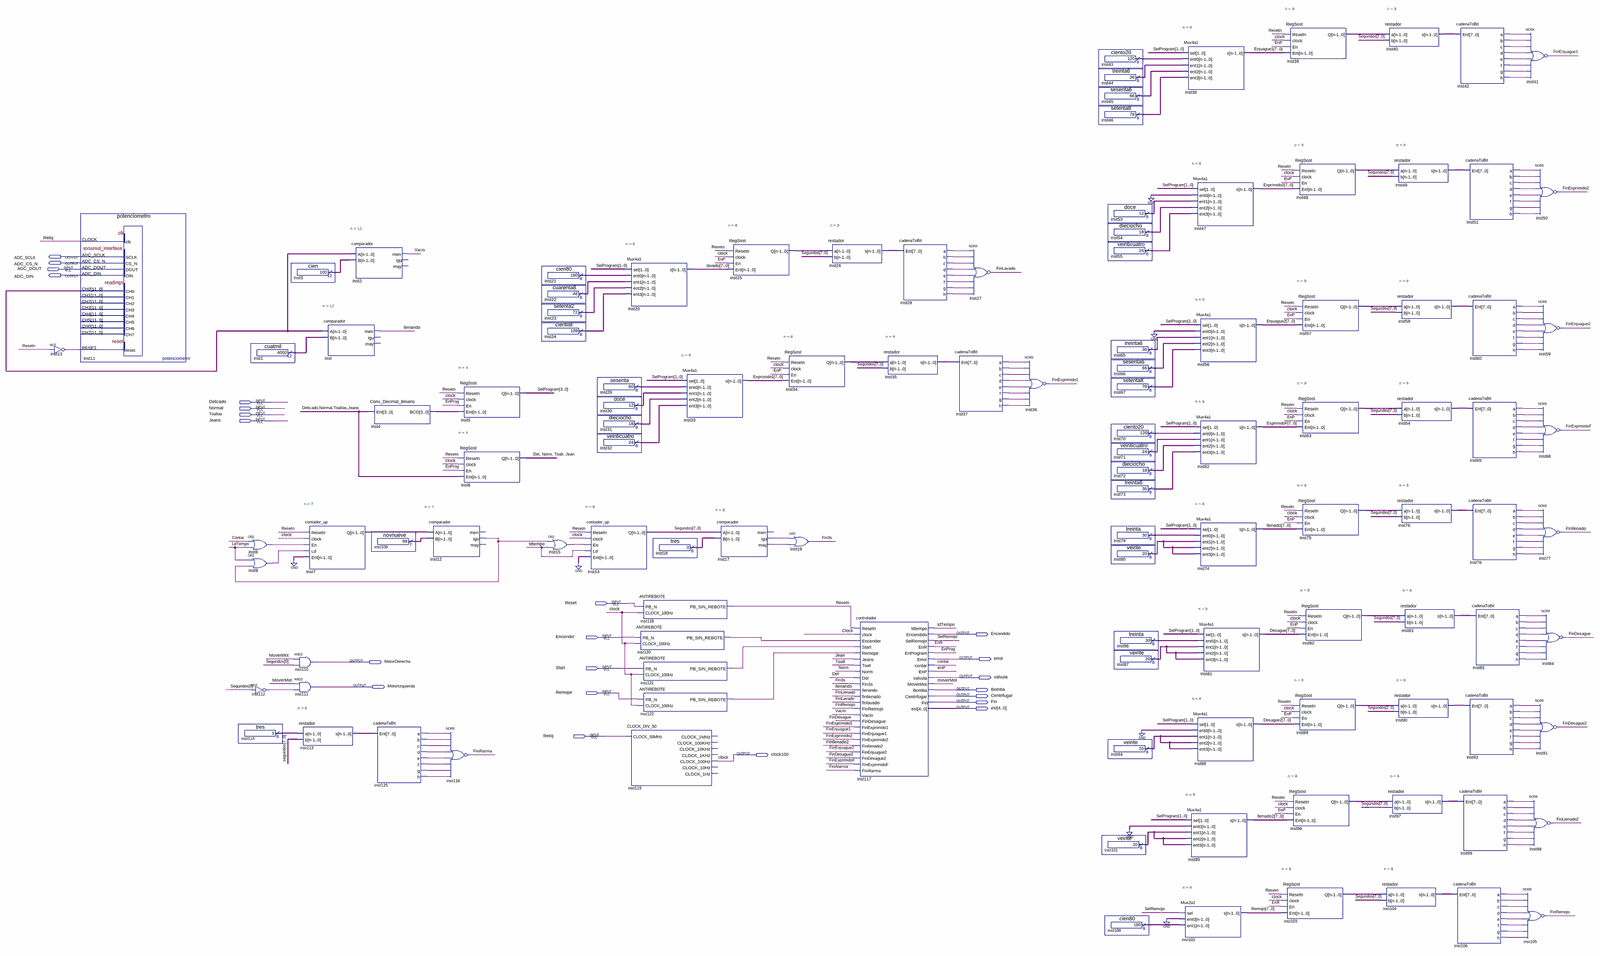
[diagram p0: schematic sheet, whole]
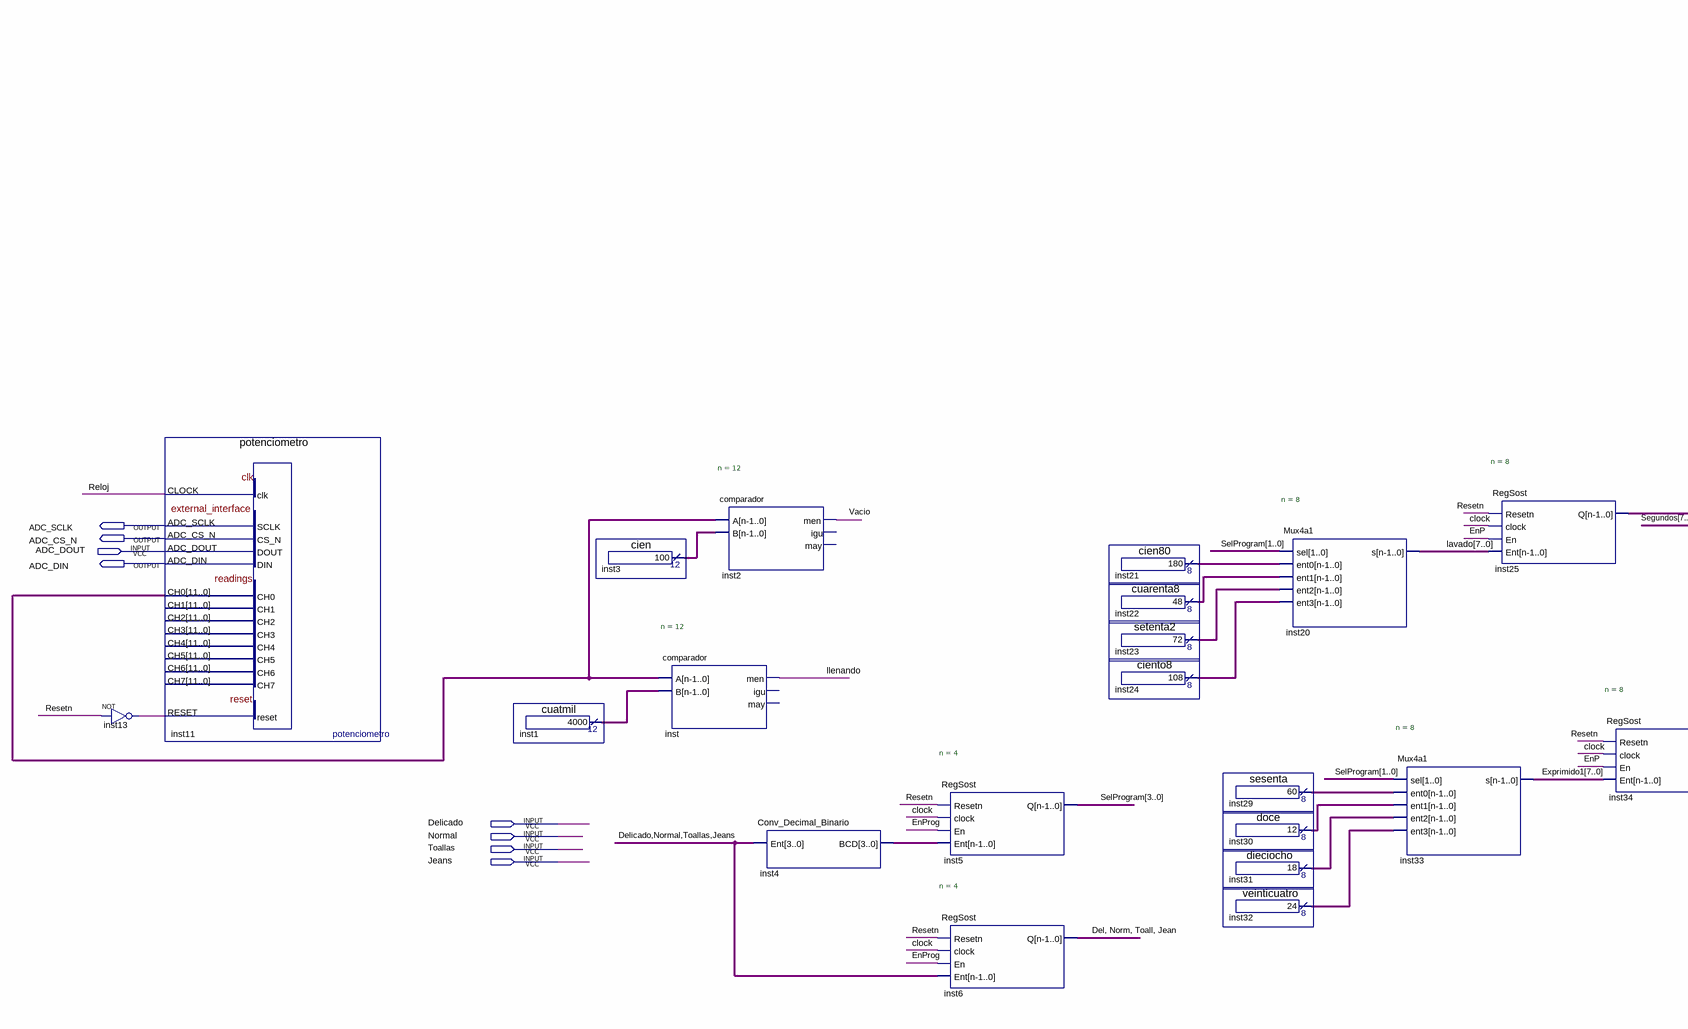
[diagram p1: schematic sheet, upper left part]
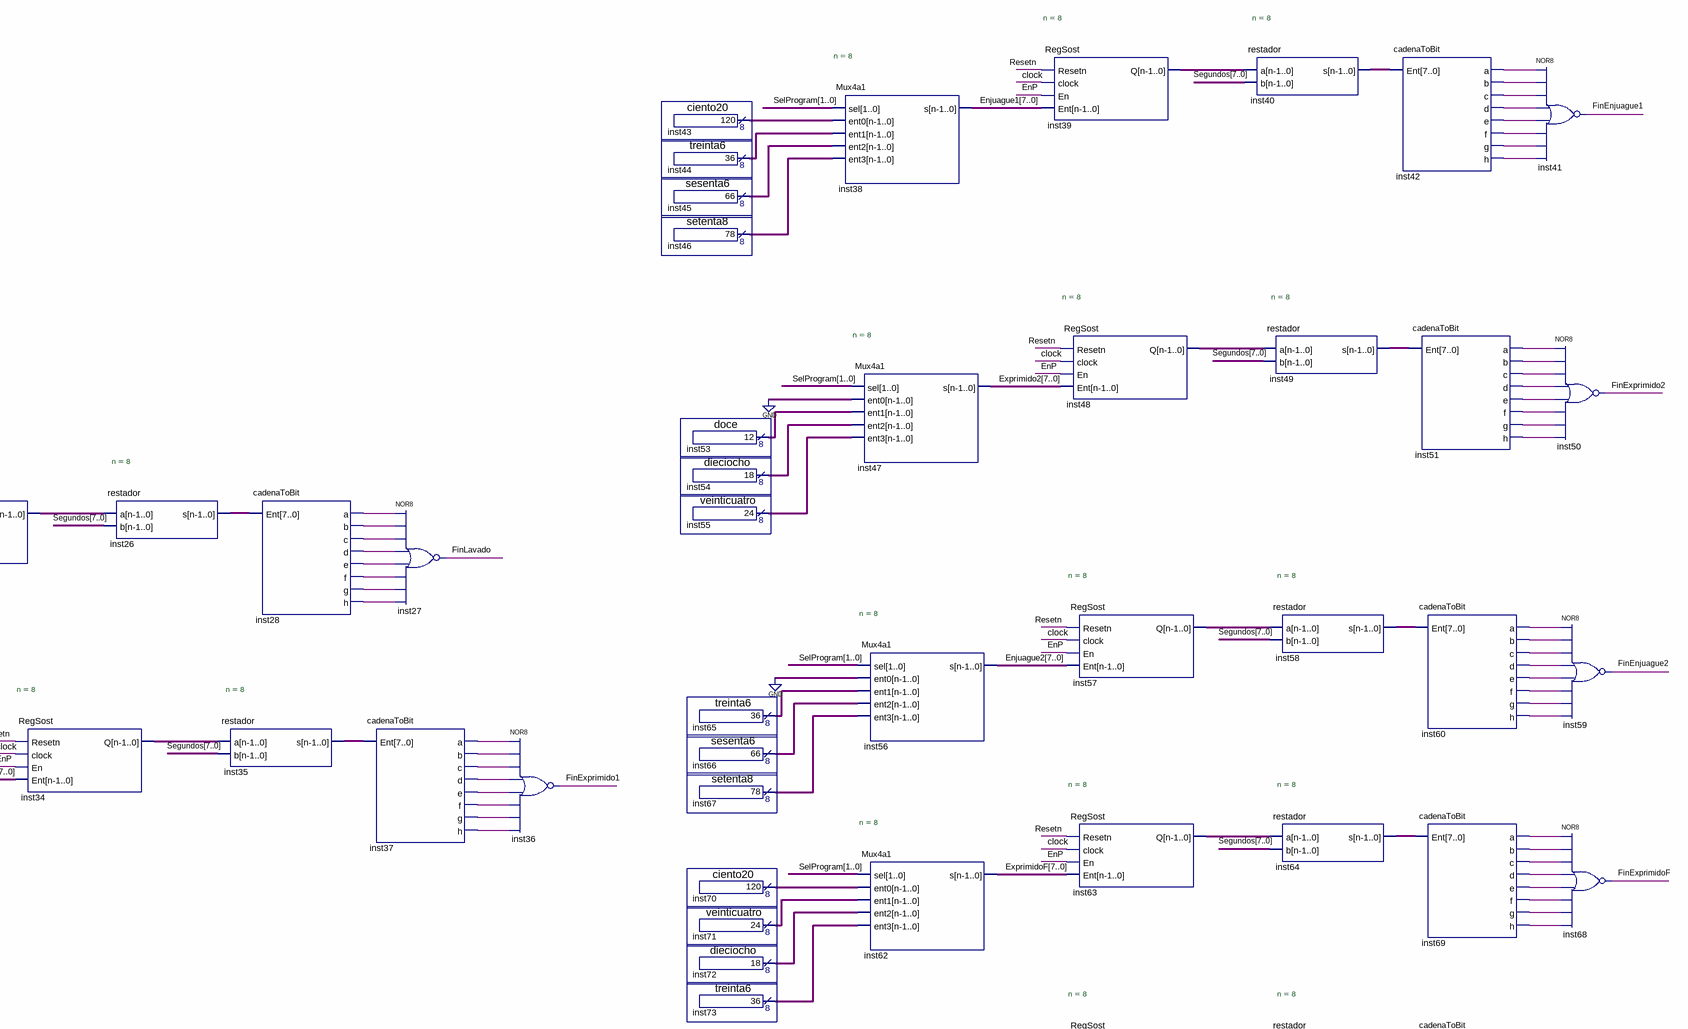
[diagram p2: schematic sheet, upper right part]
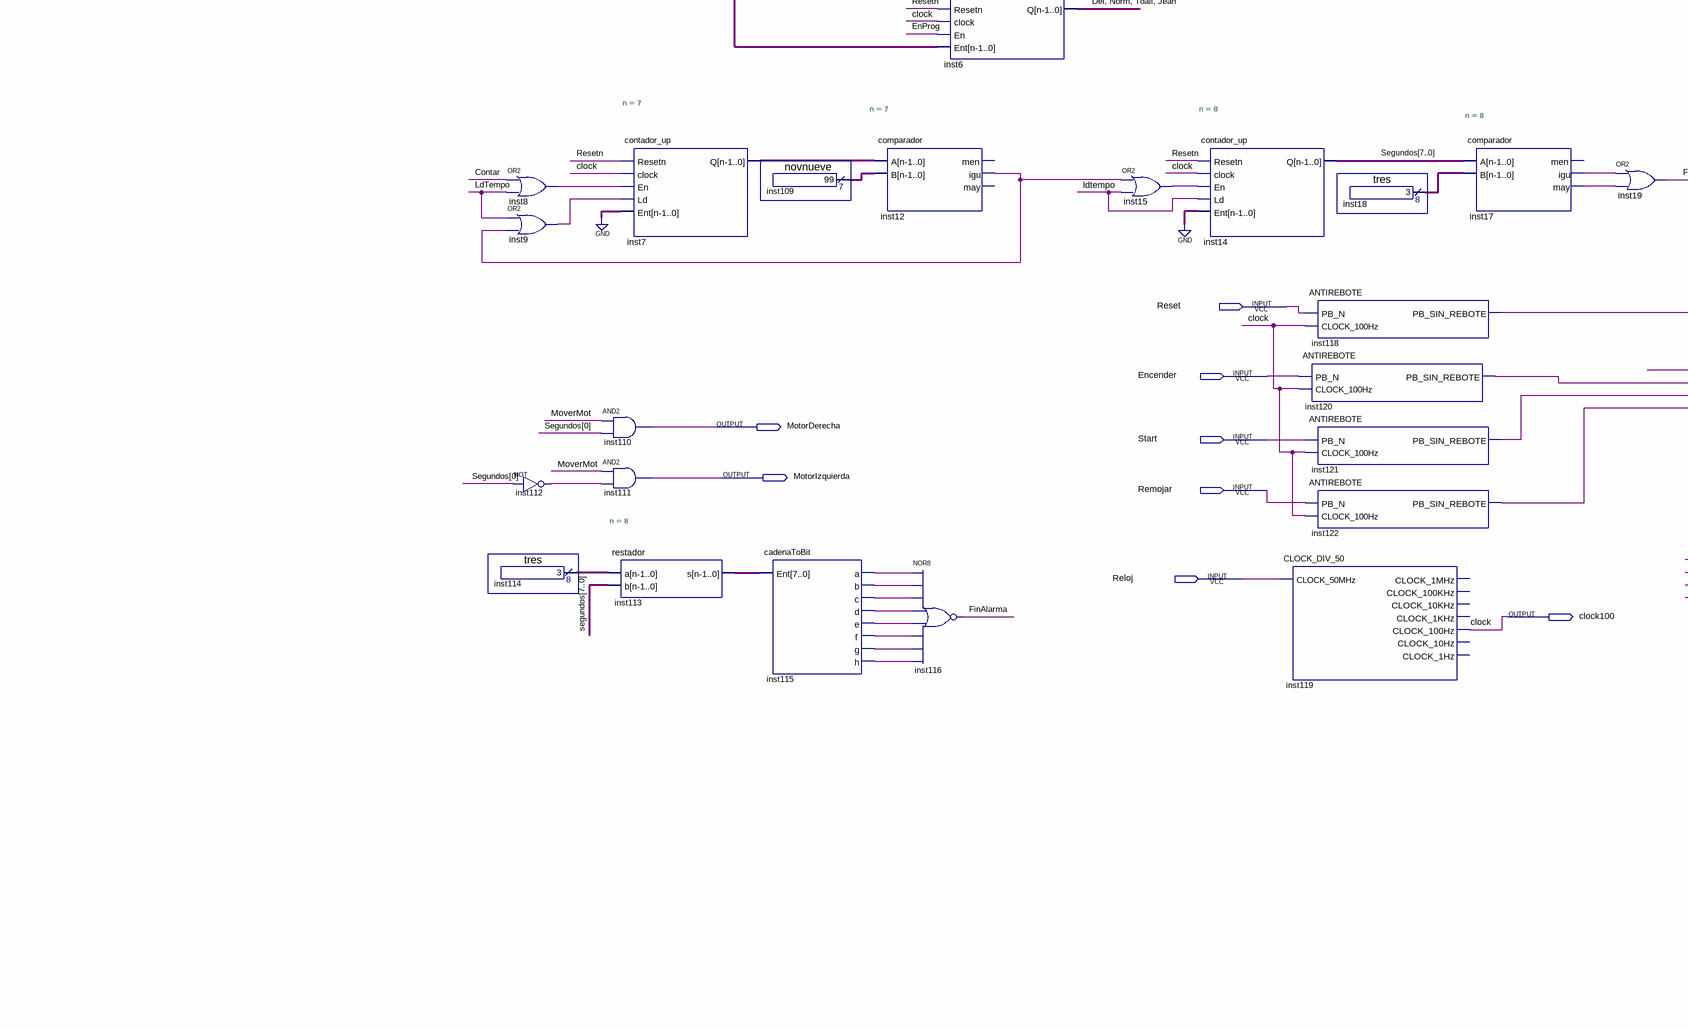
[diagram p3: schematic sheet, lower left part]
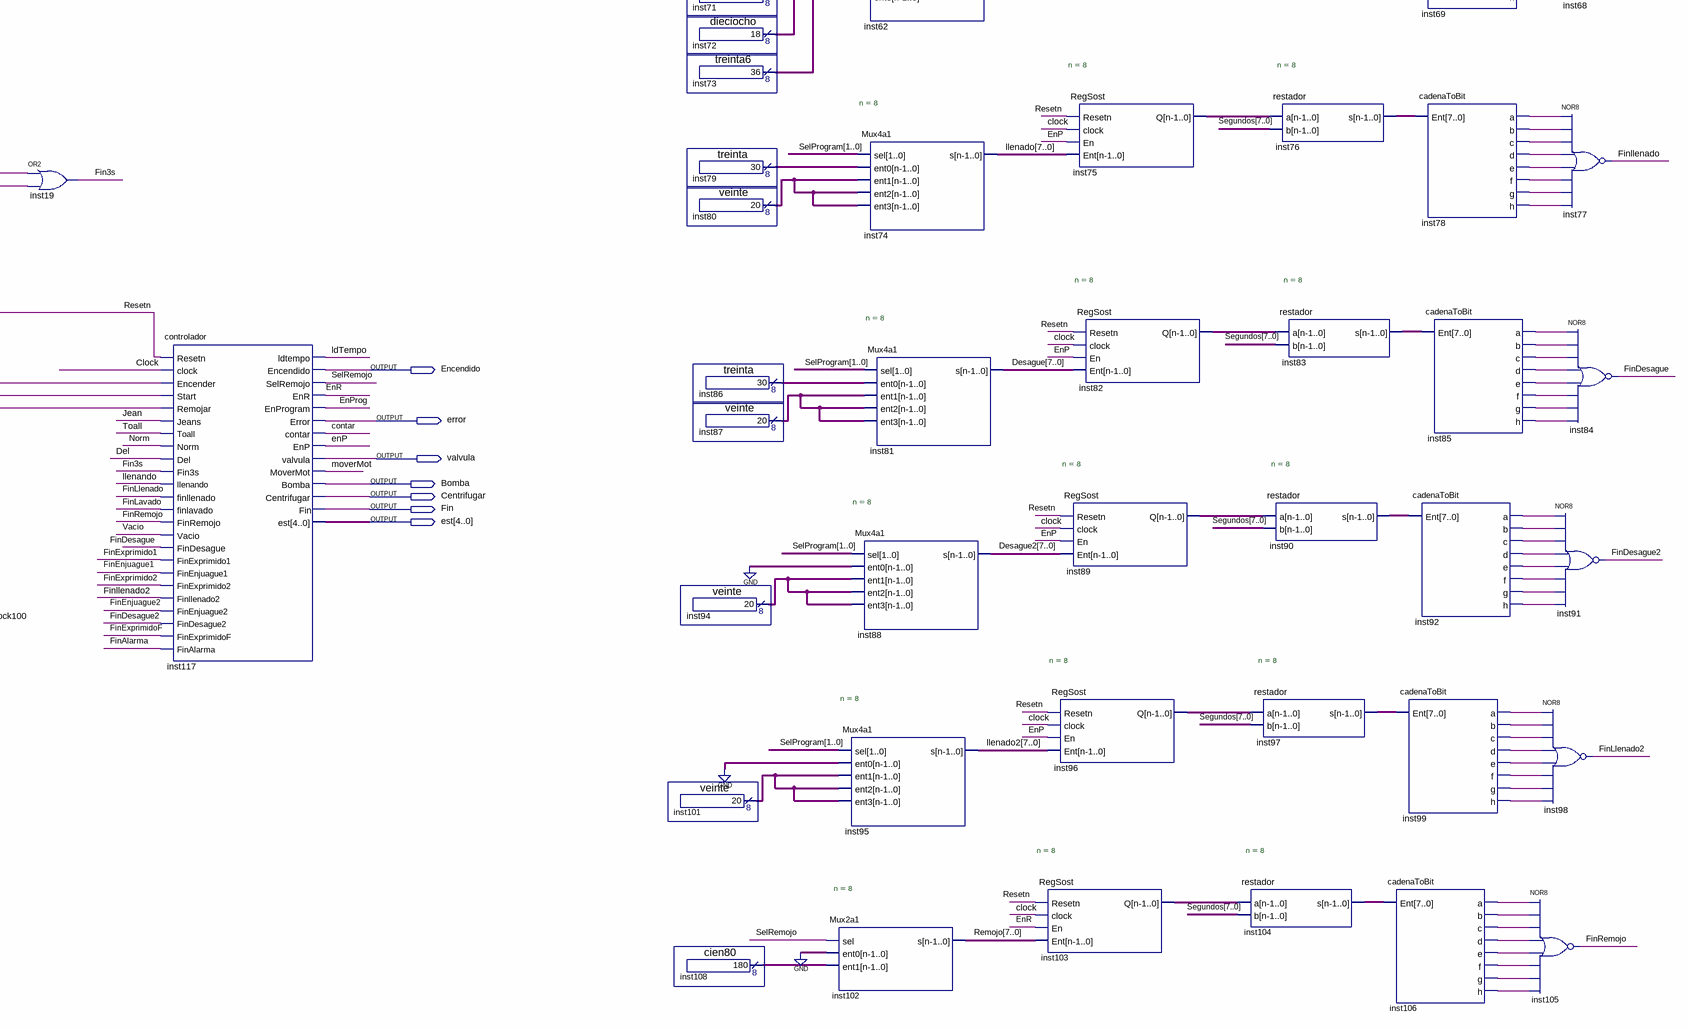
[diagram p4: schematic sheet, lower right part]
// Quartus schematic lavadora.bdf as structural Verilog: 116 symbols, 23 pins
module lavadora (
  input  ADC_DOUT,
  input  Delicado,
  input  Normal,
  input  Toallas,
  input  Jeans,
  input  Reset,
  input  Encender,
  input  Start,
  input  Remojar,
  input  Reloj,
  output ADC_SCLK,
  output ADC_CS_N,
  output ADC_DIN,
  output Encendido,
  output error,
  output MotorDerecha,
  output valvula,
  output MotorIzquierda,
  output Bomba,
  output Centrifugar,
  output Fin,
  output [4:0] est,
  output clock100
);

  wire Contar, Del, EnP, EnProg, EnR, Fin3s, FinAlarma, FinDesague, FinDesague2, FinEnjuague1, FinEnjuague2,
       FinExprimido1, FinExprimido2, FinExprimidoF, FinLavado, Finllenado, FinLlenado2, FinRemojo, inst8_out,
       inst9_out, inst12_igu, inst13_out, inst15_out, inst17_igu, inst17_may, inst28_a, inst28_b, inst28_c,
       inst28_d, inst28_e, inst28_f, inst28_g, inst28_h, inst37_a, inst37_b, inst37_c, inst37_d, inst37_e,
       inst37_f, inst37_g, inst37_h, inst42_a, inst42_b, inst42_c, inst42_d, inst42_e, inst42_f, inst42_g,
       inst42_h, inst51_a, inst51_b, inst51_c, inst51_d, inst51_e, inst51_f, inst51_g, inst51_h, inst60_a,
       inst60_b, inst60_c, inst60_d, inst60_e, inst60_f, inst60_g, inst60_h, inst69_a, inst69_b, inst69_c,
       inst69_d, inst69_e, inst69_f, inst69_g, inst69_h, inst78_a, inst78_b, inst78_c, inst78_d, inst78_e,
       inst78_f, inst78_g, inst78_h, inst85_a, inst85_b, inst85_c, inst85_d, inst85_e, inst85_f, inst85_g,
       inst85_h, inst92_a, inst92_b, inst92_c, inst92_d, inst92_e, inst92_f, inst92_g, inst92_h, inst99_a,
       inst99_b, inst99_c, inst99_d, inst99_e, inst99_f, inst99_g, inst99_h, inst106_a, inst106_b, inst106_c,
       inst106_d, inst106_e, inst106_f, inst106_g, inst106_h, inst112_out, inst115_a, inst115_b, inst115_c,
       inst115_d, inst115_e, inst115_f, inst115_g, inst115_h, inst120_pb_sin_rebote, inst121_pb_sin_rebote,
       inst122_pb_sin_rebote, Jean, LdTempo, llenando, MoverMot, Norm, Resetn, SelRemojo, Toall, Vacio;
  wire [3:0] inst4_bcd, SelProgram;
  wire [6:0] inst7_q, inst109_result;
  wire [7:0] Desague, Desague2, Enjuague1, Enjuague2, Exprimido1, Exprimido2, ExprimidoF, inst18_result,
       inst21_result, inst22_result, inst23_result, inst24_result, inst25_q, inst26_s, inst29_result,
       inst30_result, inst31_result, inst32_result, inst34_q, inst35_s, inst39_q, inst40_s, inst43_result,
       inst44_result, inst45_result, inst46_result, inst48_q, inst49_s, inst53_result, inst54_result,
       inst55_result, inst57_q, inst58_s, inst63_q, inst64_s, inst65_result, inst66_result, inst67_result,
       inst70_result, inst71_result, inst72_result, inst73_result, inst75_q, inst76_s, inst79_result,
       inst80_result, inst82_q, inst83_s, inst86_result, inst87_result, inst89_q, inst90_s, inst94_result,
       inst96_q, inst97_s, inst101_result, inst103_q, inst104_s, inst108_result, inst113_s, inst114_result,
       lavado, llenado, llenado2, Remojo, Segundos;
  wire [11:0] inst1_result, inst3_result, inst11_ch0;

  not inst13 (inst13_out, Resetn);
  potenciometro inst11 (
    .CLOCK(Reloj), .ADC_DOUT(ADC_DOUT), .RESET(inst13_out), .ADC_SCLK(ADC_SCLK), .ADC_CS_N(ADC_CS_N),
    .ADC_DIN(ADC_DIN), .CH0(inst11_ch0));  // open: CH1, CH2, CH3, CH4, CH5, CH6, CH7
  tres inst114 (.result(inst114_result));
  cuatmil inst1 (.result(inst1_result));
  or inst8 (inst8_out, Contar, LdTempo);
  or inst9 (inst9_out, LdTempo, inst12_igu);
  not inst112 (inst112_out, Segundos[0]);
  cien inst3 (.result(inst3_result));
  contador_up #(.n(7)) inst7 (
    .Resetn(Resetn), .clock(clock100), .En(inst8_out), .Ld(inst9_out), .Ent({7{1'b0}}), .Q(inst7_q));
  and inst110 (MotorDerecha, MoverMot, Segundos[0]);
  and inst111 (MotorIzquierda, MoverMot, inst112_out);
  restador #(.n(8)) inst113 (.a(inst114_result), .b(Segundos), .s(inst113_s));
  comparador #(.n(12)) inst (.A(inst11_ch0), .B(inst1_result), .men(llenando));  // open: igu, may
  comparador #(.n(12)) inst2 (.A(inst11_ch0), .B(inst3_result), .men(Vacio));  // open: igu, may
  Conv_Decimal_Binario inst4 (.Ent({Delicado, Normal, Toallas, Jeans}), .BCD(inst4_bcd));
  novnueve inst109 (.result(inst109_result));
  cadenaToBit inst115 (
    .Ent(inst113_s), .a(inst115_a), .b(inst115_b), .c(inst115_c), .d(inst115_d), .e(inst115_e),
    .f(inst115_f), .g(inst115_g), .h(inst115_h));
  comparador #(.n(7)) inst12 (.A(inst7_q), .B(inst109_result), .igu(inst12_igu));  // open: men, may
  RegSost #(.n(4)) inst5 (.Resetn(Resetn), .clock(clock100), .En(EnProg), .Ent(inst4_bcd), .Q(SelProgram));
  RegSost #(.n(4)) inst6 (
    .Resetn(Resetn), .clock(clock100), .En(EnProg), .Ent({Delicado, Normal, Toallas, Jeans}),
    .Q({Del, Norm, Toall, Jean}));
  nor inst116 (FinAlarma, inst115_a, inst115_b, inst115_c, inst115_d, inst115_e, inst115_f, inst115_g, inst115_h);
  cien80 inst21 (.result(inst21_result));
  cuarenta8 inst22 (.result(inst22_result));
  setenta2 inst23 (.result(inst23_result));
  ciento8 inst24 (.result(inst24_result));
  or inst15 (inst15_out, inst12_igu, LdTempo);
  contador_up #(.n(8)) inst14 (
    .Resetn(Resetn), .clock(clock100), .En(inst15_out), .Ld(LdTempo), .Ent({8{1'b0}}), .Q(Segundos));
  sesenta inst29 (.result(inst29_result));
  doce inst30 (.result(inst30_result));
  dieciocho inst31 (.result(inst31_result));
  veinticuatro inst32 (.result(inst32_result));
  Mux4a1 #(.n(8)) inst20 (
    .sel(SelProgram[1:0]), .ent0(inst21_result), .ent1(inst22_result), .ent2(inst23_result),
    .ent3(inst24_result), .s(lavado));
  ANTIREBOTE inst118 (.PB_N(Reset), .CLOCK_100Hz(clock100), .PB_SIN_REBOTE(Resetn));
  ANTIREBOTE inst120 (.PB_N(Encender), .CLOCK_100Hz(clock100), .PB_SIN_REBOTE(inst120_pb_sin_rebote));
  ANTIREBOTE inst121 (.PB_N(Start), .CLOCK_100Hz(clock100), .PB_SIN_REBOTE(inst121_pb_sin_rebote));
  ANTIREBOTE inst122 (.PB_N(Remojar), .CLOCK_100Hz(clock100), .PB_SIN_REBOTE(inst122_pb_sin_rebote));
  CLOCK_DIV_50 inst119 (
    .CLOCK_50MHz(Reloj), .CLOCK_100Hz(clock100));  // open: CLOCK_1MHz, CLOCK_100KHz, CLOCK_10KHz, CLOCK_1KHz, CLOCK_10Hz, CLOCK_1Hz
  tres inst18 (.result(inst18_result));
  Mux4a1 #(.n(8)) inst33 (
    .sel(SelProgram[1:0]), .ent0(inst29_result), .ent1(inst30_result), .ent2(inst31_result),
    .ent3(inst32_result), .s(Exprimido1));
  RegSost #(.n(8)) inst25 (.Resetn(Resetn), .clock(clock100), .En(EnP), .Ent(lavado), .Q(inst25_q));
  comparador #(.n(8)) inst17 (.A(Segundos), .B(inst18_result), .igu(inst17_igu), .may(inst17_may));  // open: men
  RegSost #(.n(8)) inst34 (.Resetn(Resetn), .clock(clock100), .En(EnP), .Ent(Exprimido1), .Q(inst34_q));
  or inst19 (Fin3s, inst17_igu, inst17_may);
  restador #(.n(8)) inst26 (.a(inst25_q), .b(Segundos), .s(inst26_s));
  controlador inst117 (
    .Resetn(Resetn), .clock(clock100), .Encender(inst120_pb_sin_rebote), .Start(inst121_pb_sin_rebote),
    .Remojar(inst122_pb_sin_rebote), .Jeans(Jean), .Toall(Toall), .Norm(Norm), .Del(Del), .Fin3s(Fin3s),
    .llenando(llenando), .finllenado(Finllenado), .finlavado(FinLavado), .FinRemojo(FinRemojo),
    .Vacio(Vacio), .FinDesague(FinDesague), .FinExprimido1(FinExprimido1), .FinEnjuague1(FinEnjuague1),
    .FinExprimido2(FinExprimido2), .Finllenado2(FinLlenado2), .FinEnjuague2(FinEnjuague2),
    .FinDesague2(FinDesague2), .FinExprimidoF(FinExprimidoF), .FinAlarma(FinAlarma), .ldtempo(LdTempo),
    .Encendido(Encendido), .SelRemojo(SelRemojo), .EnR(EnR), .EnProgram(EnProg), .Error(error),
    .contar(Contar), .EnP(EnP), .valvula(valvula), .MoverMot(MoverMot), .Bomba(Bomba),
    .Centrifugar(Centrifugar), .Fin(Fin), .est(est));
  restador #(.n(8)) inst35 (.a(inst34_q), .b(Segundos), .s(inst35_s));
  cadenaToBit inst28 (
    .Ent(inst26_s), .a(inst28_a), .b(inst28_b), .c(inst28_c), .d(inst28_d), .e(inst28_e), .f(inst28_f),
    .g(inst28_g), .h(inst28_h));
  cadenaToBit inst37 (
    .Ent(inst35_s), .a(inst37_a), .b(inst37_b), .c(inst37_c), .d(inst37_d), .e(inst37_e), .f(inst37_f),
    .g(inst37_g), .h(inst37_h));
  nor inst27 (FinLavado, inst28_a, inst28_b, inst28_c, inst28_d, inst28_e, inst28_f, inst28_g, inst28_h);
  nor inst36 (FinExprimido1, inst37_a, inst37_b, inst37_c, inst37_d, inst37_e, inst37_f, inst37_g, inst37_h);
  ciento20 inst43 (.result(inst43_result));
  treinta6 inst44 (.result(inst44_result));
  sesenta6 inst45 (.result(inst45_result));
  setenta8 inst46 (.result(inst46_result));
  doce inst53 (.result(inst53_result));
  dieciocho inst54 (.result(inst54_result));
  veinticuatro inst55 (.result(inst55_result));
  veinte inst94 (.result(inst94_result));
  veinte inst101 (.result(inst101_result));
  cien80 inst108 (.result(inst108_result));
  treinta6 inst65 (.result(inst65_result));
  sesenta6 inst66 (.result(inst66_result));
  setenta8 inst67 (.result(inst67_result));
  ciento20 inst70 (.result(inst70_result));
  veinticuatro inst71 (.result(inst71_result));
  dieciocho inst72 (.result(inst72_result));
  treinta6 inst73 (.result(inst73_result));
  treinta inst79 (.result(inst79_result));
  veinte inst80 (.result(inst80_result));
  treinta inst86 (.result(inst86_result));
  veinte inst87 (.result(inst87_result));
  Mux4a1 #(.n(8)) inst38 (
    .sel(SelProgram[1:0]), .ent0(inst43_result), .ent1(inst44_result), .ent2(inst45_result),
    .ent3(inst46_result), .s(Enjuague1));
  Mux2a1 #(.n(8)) inst102 (.sel(SelRemojo), .ent0({8{1'b0}}), .ent1(inst108_result), .s(Remojo));
  Mux4a1 #(.n(8)) inst47 (
    .sel(SelProgram[1:0]), .ent0({8{1'b0}}), .ent1(inst53_result), .ent2(inst54_result),
    .ent3(inst55_result), .s(Exprimido2));
  Mux4a1 #(.n(8)) inst56 (
    .sel(SelProgram[1:0]), .ent0({8{1'b0}}), .ent1(inst65_result), .ent2(inst66_result),
    .ent3(inst67_result), .s(Enjuague2));
  Mux4a1 #(.n(8)) inst62 (
    .sel(SelProgram[1:0]), .ent0(inst70_result), .ent1(inst71_result), .ent2(inst72_result),
    .ent3(inst73_result), .s(ExprimidoF));
  Mux4a1 #(.n(8)) inst74 (
    .sel(SelProgram[1:0]), .ent0(inst79_result), .ent1(inst80_result), .ent2(inst80_result),
    .ent3(inst80_result), .s(llenado));
  Mux4a1 #(.n(8)) inst81 (
    .sel(SelProgram[1:0]), .ent0(inst86_result), .ent1(inst87_result), .ent2(inst87_result),
    .ent3(inst87_result), .s(Desague));
  Mux4a1 #(.n(8)) inst88 (
    .sel(SelProgram[1:0]), .ent0({8{1'b0}}), .ent1(inst94_result), .ent2(inst94_result),
    .ent3(inst94_result), .s(Desague2));
  Mux4a1 #(.n(8)) inst95 (
    .sel(SelProgram[1:0]), .ent0({8{1'b0}}), .ent1(inst101_result), .ent2(inst101_result),
    .ent3(inst101_result), .s(llenado2));
  RegSost #(.n(8)) inst103 (.Resetn(Resetn), .clock(clock100), .En(EnR), .Ent(Remojo), .Q(inst103_q));
  RegSost #(.n(8)) inst39 (.Resetn(Resetn), .clock(clock100), .En(EnP), .Ent(Enjuague1), .Q(inst39_q));
  RegSost #(.n(8)) inst48 (.Resetn(Resetn), .clock(clock100), .En(EnP), .Ent(Exprimido2), .Q(inst48_q));
  RegSost #(.n(8)) inst57 (.Resetn(Resetn), .clock(clock100), .En(EnP), .Ent(Enjuague2), .Q(inst57_q));
  RegSost #(.n(8)) inst63 (.Resetn(Resetn), .clock(clock100), .En(EnP), .Ent(ExprimidoF), .Q(inst63_q));
  RegSost #(.n(8)) inst75 (.Resetn(Resetn), .clock(clock100), .En(EnP), .Ent(llenado), .Q(inst75_q));
  RegSost #(.n(8)) inst82 (.Resetn(Resetn), .clock(clock100), .En(EnP), .Ent(Desague), .Q(inst82_q));
  RegSost #(.n(8)) inst89 (.Resetn(Resetn), .clock(clock100), .En(EnP), .Ent(Desague2), .Q(inst89_q));
  RegSost #(.n(8)) inst96 (.Resetn(Resetn), .clock(clock100), .En(EnP), .Ent(llenado2), .Q(inst96_q));
  restador #(.n(8)) inst104 (.a(inst103_q), .b(Segundos), .s(inst104_s));
  restador #(.n(8)) inst40 (.a(inst39_q), .b(Segundos), .s(inst40_s));
  restador #(.n(8)) inst49 (.a(inst48_q), .b(Segundos), .s(inst49_s));
  restador #(.n(8)) inst58 (.a(inst57_q), .b(Segundos), .s(inst58_s));
  restador #(.n(8)) inst64 (.a(inst63_q), .b(Segundos), .s(inst64_s));
  restador #(.n(8)) inst76 (.a(inst75_q), .b(Segundos), .s(inst76_s));
  restador #(.n(8)) inst83 (.a(inst82_q), .b(Segundos), .s(inst83_s));
  restador #(.n(8)) inst90 (.a(inst89_q), .b(Segundos), .s(inst90_s));
  restador #(.n(8)) inst97 (.a(inst96_q), .b(Segundos), .s(inst97_s));
  cadenaToBit inst42 (
    .Ent(inst40_s), .a(inst42_a), .b(inst42_b), .c(inst42_c), .d(inst42_d), .e(inst42_e), .f(inst42_f),
    .g(inst42_g), .h(inst42_h));
  cadenaToBit inst106 (
    .Ent(inst104_s), .a(inst106_a), .b(inst106_b), .c(inst106_c), .d(inst106_d), .e(inst106_e),
    .f(inst106_f), .g(inst106_g), .h(inst106_h));
  cadenaToBit inst51 (
    .Ent(inst49_s), .a(inst51_a), .b(inst51_b), .c(inst51_c), .d(inst51_d), .e(inst51_e), .f(inst51_f),
    .g(inst51_g), .h(inst51_h));
  cadenaToBit inst60 (
    .Ent(inst58_s), .a(inst60_a), .b(inst60_b), .c(inst60_c), .d(inst60_d), .e(inst60_e), .f(inst60_f),
    .g(inst60_g), .h(inst60_h));
  cadenaToBit inst69 (
    .Ent(inst64_s), .a(inst69_a), .b(inst69_b), .c(inst69_c), .d(inst69_d), .e(inst69_e), .f(inst69_f),
    .g(inst69_g), .h(inst69_h));
  cadenaToBit inst78 (
    .Ent(inst76_s), .a(inst78_a), .b(inst78_b), .c(inst78_c), .d(inst78_d), .e(inst78_e), .f(inst78_f),
    .g(inst78_g), .h(inst78_h));
  cadenaToBit inst85 (
    .Ent(inst83_s), .a(inst85_a), .b(inst85_b), .c(inst85_c), .d(inst85_d), .e(inst85_e), .f(inst85_f),
    .g(inst85_g), .h(inst85_h));
  cadenaToBit inst92 (
    .Ent(inst90_s), .a(inst92_a), .b(inst92_b), .c(inst92_c), .d(inst92_d), .e(inst92_e), .f(inst92_f),
    .g(inst92_g), .h(inst92_h));
  cadenaToBit inst99 (
    .Ent(inst97_s), .a(inst99_a), .b(inst99_b), .c(inst99_c), .d(inst99_d), .e(inst99_e), .f(inst99_f),
    .g(inst99_g), .h(inst99_h));
  nor inst41 (FinEnjuague1, inst42_a, inst42_b, inst42_c, inst42_d, inst42_e, inst42_f, inst42_g, inst42_h);
  nor inst98 (FinLlenado2, inst99_a, inst99_b, inst99_c, inst99_d, inst99_e, inst99_f, inst99_g, inst99_h);
  nor inst105 (FinRemojo, inst106_a, inst106_b, inst106_c, inst106_d, inst106_e, inst106_f, inst106_g, inst106_h);
  nor inst50 (FinExprimido2, inst51_a, inst51_b, inst51_c, inst51_d, inst51_e, inst51_f, inst51_g, inst51_h);
  nor inst59 (FinEnjuague2, inst60_a, inst60_b, inst60_c, inst60_d, inst60_e, inst60_f, inst60_g, inst60_h);
  nor inst68 (FinExprimidoF, inst69_a, inst69_b, inst69_c, inst69_d, inst69_e, inst69_f, inst69_g, inst69_h);
  nor inst77 (Finllenado, inst78_a, inst78_b, inst78_c, inst78_d, inst78_e, inst78_f, inst78_g, inst78_h);
  nor inst84 (FinDesague, inst85_a, inst85_b, inst85_c, inst85_d, inst85_e, inst85_f, inst85_g, inst85_h);
  nor inst91 (FinDesague2, inst92_a, inst92_b, inst92_c, inst92_d, inst92_e, inst92_f, inst92_g, inst92_h);

  // Other names for the same wires on the sheet: clock = clock100
endmodule
